# Altium schematic sheet LED.SchDoc
size A
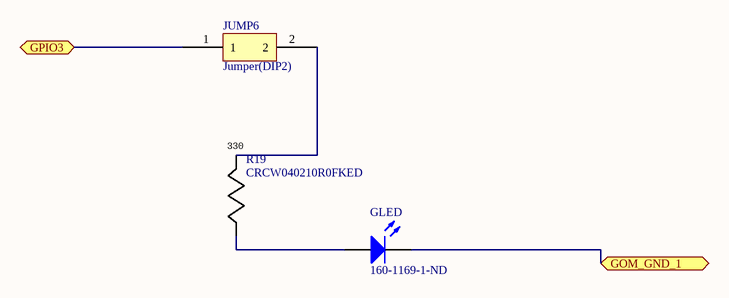
[diagram p0: LED.SchDoc]

## Parts
GLED  160-1169-1-ND  [3.2X1.6X1.1]
JUMP6  Jumper(DIP2)  [Jumper(DIP2)]
R19  CRCW040210R0FKED  value 330  [0402]

## Ports
GOM_GND_1 (bidir), GPIO3 (bidir)

## Nets
GOM_GND_1: GLED.2(K) ; port GOM_GND_1
GPIO3: JUMP6.1 ; port GPIO3
NetGLED_1: GLED.1(A) R19.2
NetJUMP6_2: JUMP6.2 R19.1

## Library data of the parts
GLED = LED2: Typical RED, GREEN, YELLOW, AMBER GaAs LED; Published: 8-Jun-2000; LatestRevisionDate: 17-Jul-2002; LatestRevisionNote: Re-released for DXP Platform.; PackageVersion: Feb-2002; PackageReference: 3.2X1.6X1.1; Publisher: Altium Limited; PackageDescription: SM LED; 2 Flat Leads
R19 = CRCW040210R0FKED: Imported; Vendor: Vishay-Dale; Manufacturer_Part_Number: CRCW040210R0FKED; Manufacturer_Name: Vishay-Dale; RefDes: RefDes; TYPE: TYPE